# Altium schematic sheet Sheet1.SchDoc
size A4
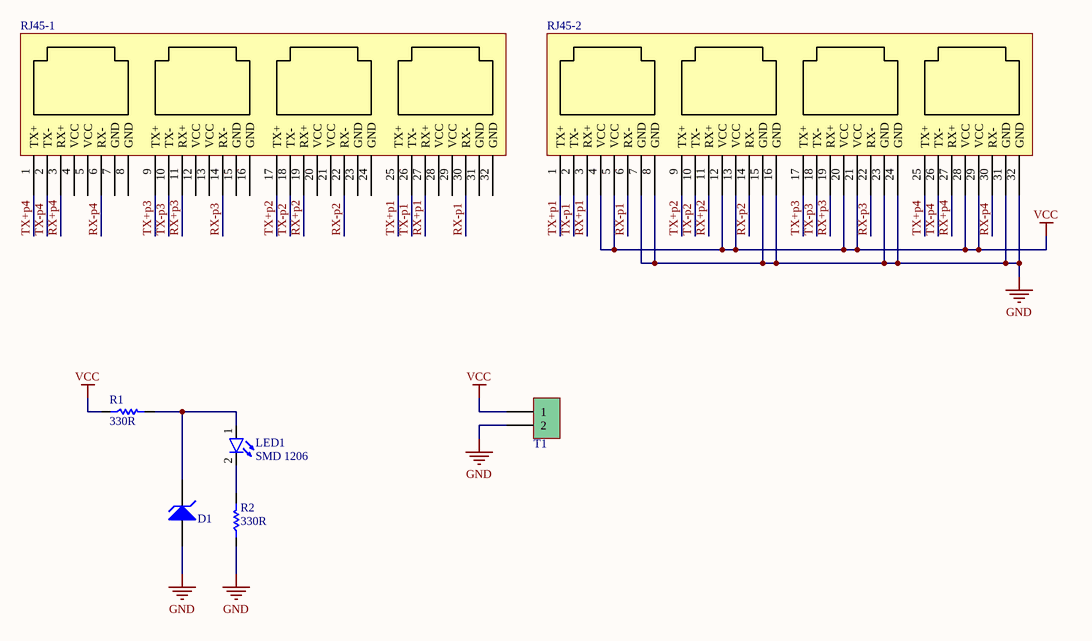
[diagram p0: Sheet1.SchDoc]

## Parts
D1  Diode Zener  [Diode 1W]  (value not drawn)
LED1  Size: SMD 1206  [LED-5mm]  (hidden comment: Red)
R1  330R  [RES 1206 (3216X08L)]
R2  330R  [RES 1206 (3216X08L)]
RJ45-1  (no value)  [rj45-w57-4]
RJ45-2  (no value)  [rj45-w57-4]
T1  Phoenix terminal  [phoenix terminal 2]  (value not drawn)

## Nets
GND: D1.1(A) R2.1 RJ45-2.7(GND) RJ45-2.8(GND) RJ45-2.15(GND) RJ45-2.16(GND) RJ45-2.23(GND) RJ45-2.24(GND) RJ45-2.31(GND) RJ45-2.32(GND) T1.2
VCC: R1.1 RJ45-2.4(VCC) RJ45-2.5(VCC) RJ45-2.12(VCC) RJ45-2.13(VCC) RJ45-2.20(VCC) RJ45-2.21(VCC) RJ45-2.28(VCC) RJ45-2.29(VCC) T1.1
RX+p1: RJ45-1.27(RX+) RJ45-2.3(RX+)
RX+p2: RJ45-1.19(RX+) RJ45-2.11(RX+)
RX+p3: RJ45-1.11(RX+) RJ45-2.19(RX+)
RX+p4: RJ45-1.3(RX+) RJ45-2.27(RX+)
RX-p1: RJ45-1.30(RX-) RJ45-2.6(RX-)
RX-p2: RJ45-1.22(RX-) RJ45-2.14(RX-)
RX-p3: RJ45-1.14(RX-) RJ45-2.22(RX-)
RX-p4: RJ45-1.6(RX-) RJ45-2.30(RX-)
TX+p1: RJ45-1.25(TX+) RJ45-2.1(TX+)
TX+p2: RJ45-1.17(TX+) RJ45-2.9(TX+)
TX+p3: RJ45-1.9(TX+) RJ45-2.17(TX+)
TX+p4: RJ45-1.1(TX+) RJ45-2.25(TX+)
TX-p1: RJ45-1.26(TX-) RJ45-2.2(TX-)
TX-p2: RJ45-1.18(TX-) RJ45-2.10(TX-)
TX-p3: RJ45-1.10(TX-) RJ45-2.18(TX-)
TX-p4: RJ45-1.2(TX-) RJ45-2.26(TX-)
NetD1_2: D1.2(K) LED1.1(A) R1.2
NetLED1_2: LED1.2(K) R2.2

Not connected (* = marked no-connect by the designer): RJ45-1 4(VCC) 5(VCC) 7(GND) 8(GND) 12(VCC) 13(VCC) 15(GND) 16(GND) 20(VCC) 21(VCC) 23(GND) 24(GND) 28(VCC) 29(VCC) 31(GND) 32(GND)

## Library data of the parts
D1 = Diode Zener: Zener Diode; Designer: Saeid Jorablo; Company: E.P.I.L; Voltage: 12V; Design Date: 2011/11/02
LED1 = LED: Designer: Saeid Jorablo; Organazation: ControTec; Adding Date: 1387/12/22; Color: Red
R1 R2 = Resistor: Tolerance: 5%; Power: 1/8 W; Value: 330R
RJ45-1 RJ45-2 = RJ45-w57-4
T1 = Phoenix terminal 2: Terminal 2 Pin; Designer: Seyed Mohsen Ghasemain; E-mail: picpars@gmail.com; ComponentLinkURL: www.picpars.com